# Altium project Propeller dev board.PrjPcb
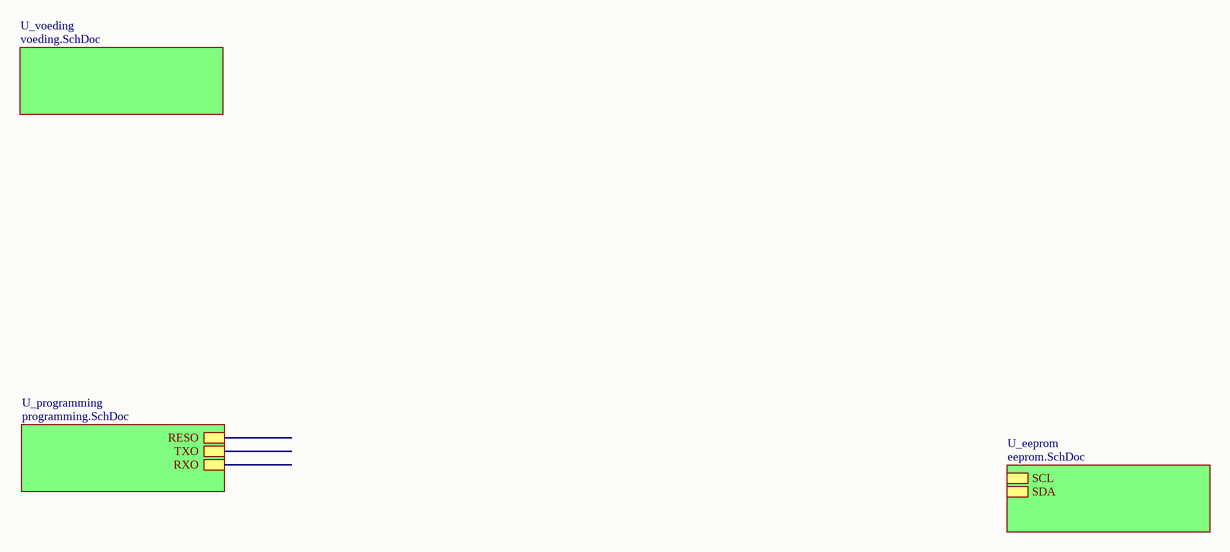
[diagram p0: top.SchDoc]
8 sheets, 54 parts. Net scope: hierarchical (ports join the sheet entries above them; power ports are global).
Sheets:
  top.SchDoc
    U_voeding = voeding.SchDoc
    U_programming = programming.SchDoc
    U_eeprom = eeprom.SchDoc
  output.SchDoc
  controller.SchDoc
  levelshifter2.SchDoc
  levelshifter1.SchDoc

## Sheet top.SchDoc
size A

### Sub-sheets
U_eeprom = eeprom.SchDoc: SCL, SDA
U_programming = programming.SchDoc: RESO, TXO, RXO
U_voeding = voeding.SchDoc: no entries

## Sheet voeding.SchDoc
size A
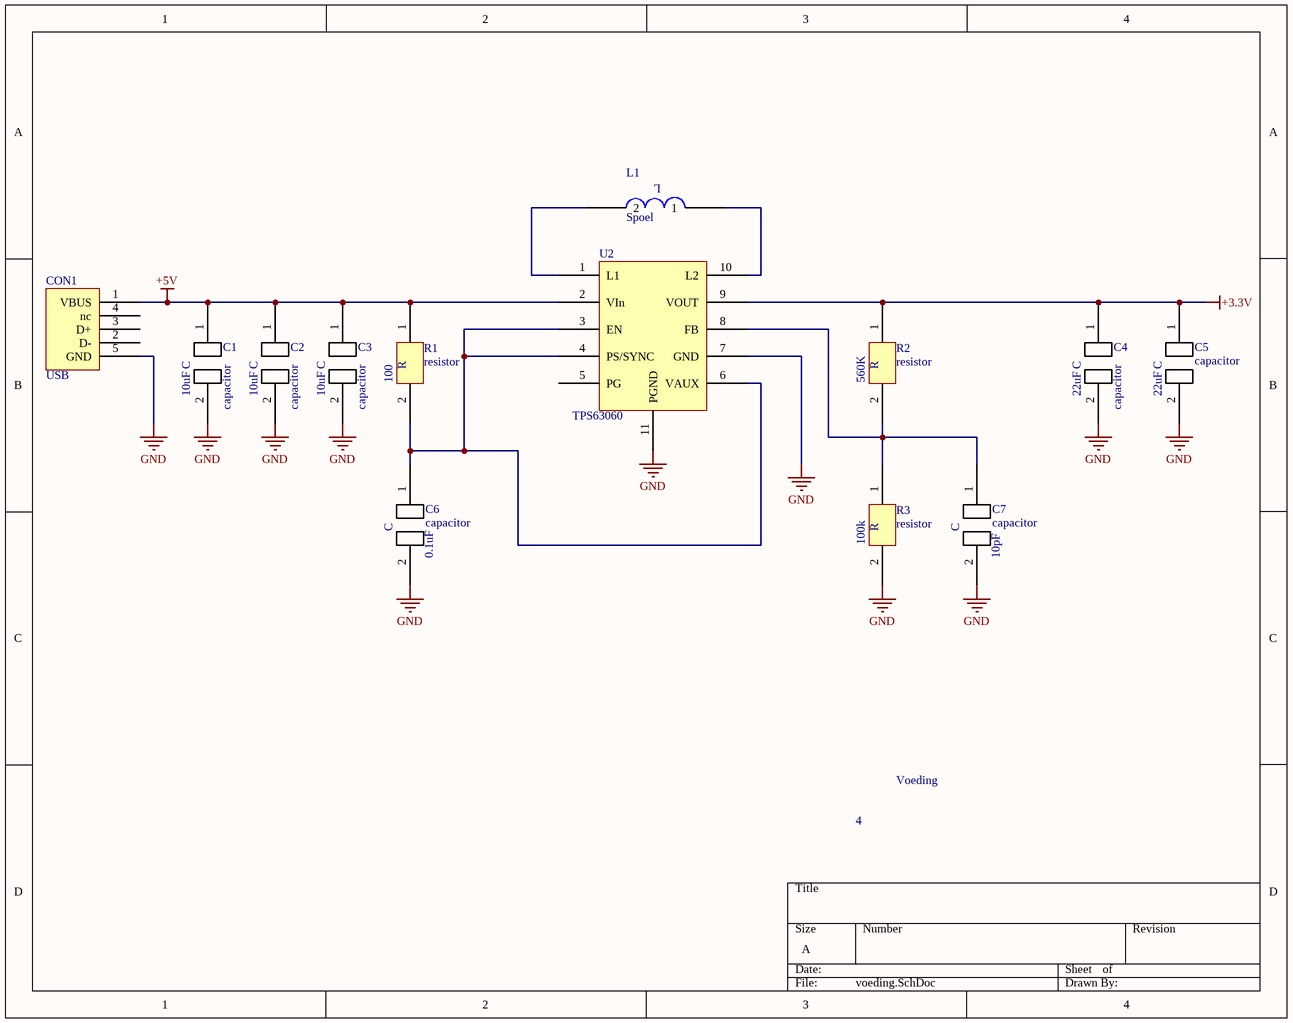
[diagram p1: voeding.SchDoc]

### Parts
C1  capacitor  value 10uF  [0603]
C2  capacitor  value 10uF  [0603]
C3  capacitor  value 10uF  [0603]
C4  capacitor  value 22uF  [0603]
C5  capacitor  value 22uF  [0603]
C6  capacitor  [0805]
C7  capacitor  [0805]
CON1  USB  [USB]
L1  Spoel  [Coilcraft , XFL4020-102]
R1  resistor  value 100  [0603]
R2  resistor  value 560K  [0603]
R3  resistor  value 100k  [0603]
U2  TPS63060  [TPS63060]

### Nets
+3.3V: C4.1 C5.1 R2.1 U2.9(VOUT)
+5V: C1.1 C2.1 C3.1 CON1.1(VBUS) R1.1 U2.2(VIn)
GND: C1.2 C2.2 C3.2 C4.2 C5.2 C6.2 C7.2 CON1.5(GND) R3.2 U2.7(GND) U2.11(PGND)
NetC6_1: C6.1 R1.2 U2.3(EN) U2.4(PS/SYNC) U2.6(VAUX)
NetC7_1: C7.1 R2.2 R3.1 U2.8(FB)
NetL1_1: L1.1 U2.10(L2)
NetL1_2: L1.2 U2.1(L1)

Not connected (* = marked no-connect by the designer): CON1 2(D-) 3(D+) 4(nc); U2 5(PG)

### Notes on the sheet
- 4
- Voeding
- (in symbol capacitor) C; 10pF; 0.1uF
- (in symbol resistor) R
- (in symbol Spoel) L

## Sheet programming.SchDoc
size A
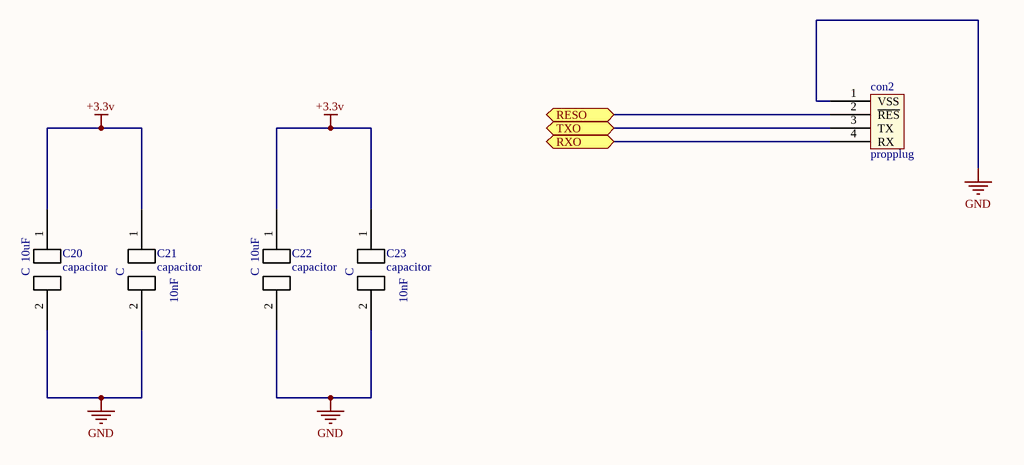
[diagram p2: programming.SchDoc]

### Parts
C20  capacitor  [0603]
C21  capacitor  [0603]
C22  capacitor  [0603]
C23  capacitor  [0603]
con2  propplug

### Ports
RESO, RXO, TXO

### Nets
+3.3V: C20.1 C21.1 C22.1 C23.1
GND: C20.2 C21.2 C22.2 C23.2 con2.1(VSS)
Netcon2_2: con2.2(~{RES}) ; port RESO
Netcon2_3: con2.3(TX) ; port TXO
Netcon2_4: con2.4(RX) ; port RXO

### Notes on the sheet
- (in symbol capacitor) 10uF; C; 10nF

## Sheet eeprom.SchDoc
size A
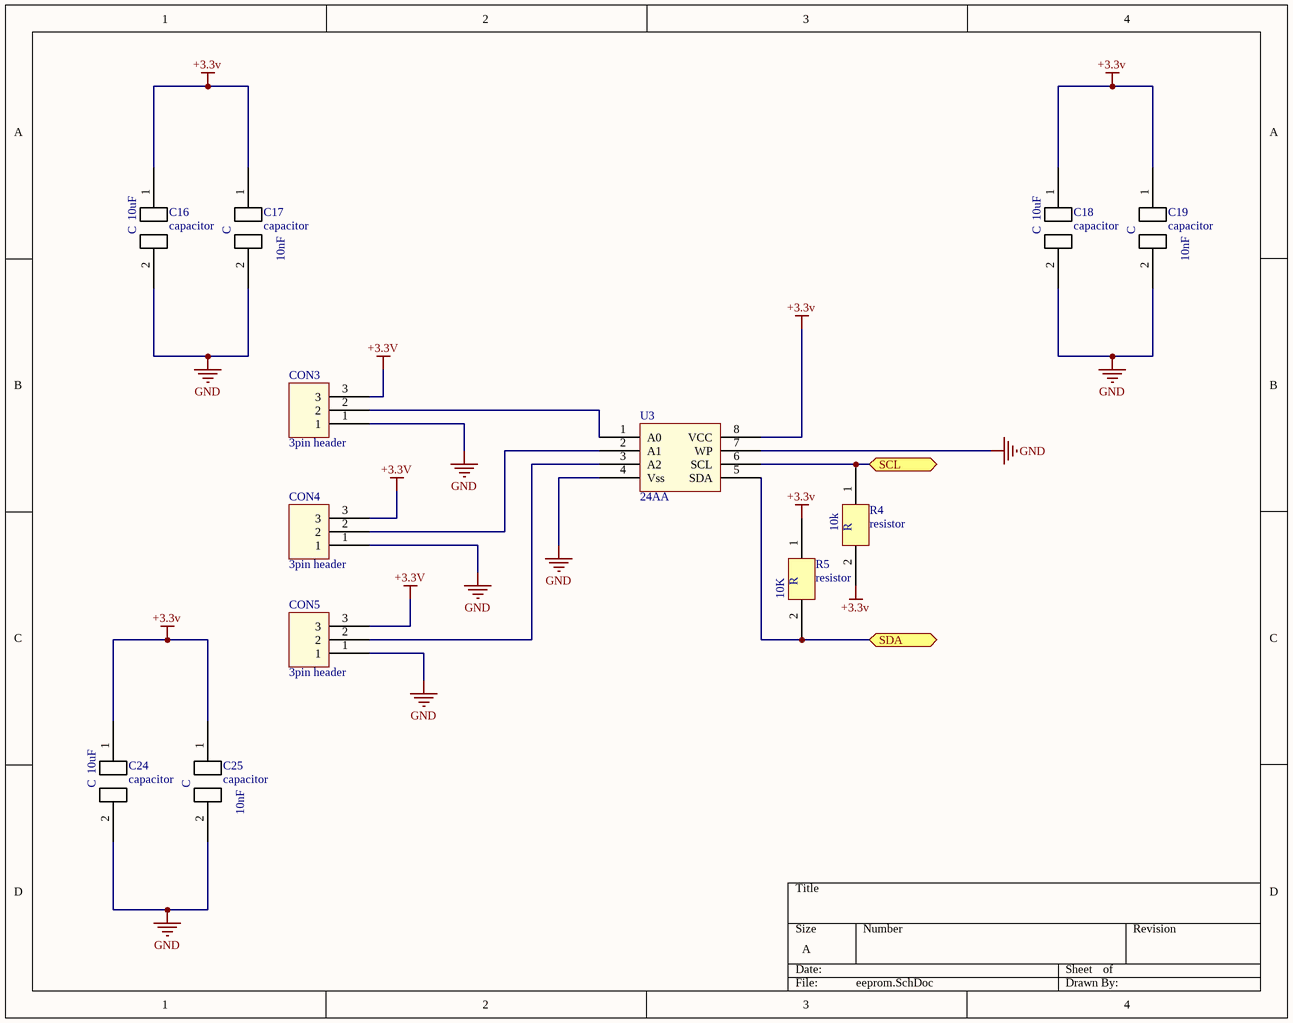
[diagram p3: eeprom.SchDoc]

### Parts
C16  capacitor  [0603]
C17  capacitor  [0603]
C18  capacitor  [0603]
C19  capacitor  [0603]
C24  capacitor  [0603]
C25  capacitor  [0603]
CON3  3pin header  [PCBComponent_1]
CON4  3pin header  [PCBComponent_1]
CON5  3pin header  [PCBComponent_1]
R4  resistor  [0603]
R5  resistor  [0603]
U3  24AA  [24AA soic]

### Ports
SCL, SDA

### Nets
+3.3V: C16.1 C17.1 C18.1 C19.1 C24.1 C25.1 CON3.3 CON4.3 CON5.3 R4.2 R5.1 U3.8(VCC)
GND: C16.2 C17.2 C18.2 C19.2 C24.2 C25.2 CON3.1 CON4.1 CON5.1 U3.4(Vss) U3.7(WP)
NetCON3_2: CON3.2 U3.1(A0)
NetCON4_2: CON4.2 U3.2(A1)
NetCON5_2: CON5.2 U3.3(A2)
NetR4_1: R4.1 U3.6(SCL) ; port SCL
NetR5_2: R5.2 U3.5(SDA) ; port SDA

### Notes on the sheet
- (in symbol capacitor) 10uF; C; 10nF
- (in symbol resistor) R; 10K; 10k

## Sheet output.SchDoc
size A

## Sheet controller.SchDoc
size A
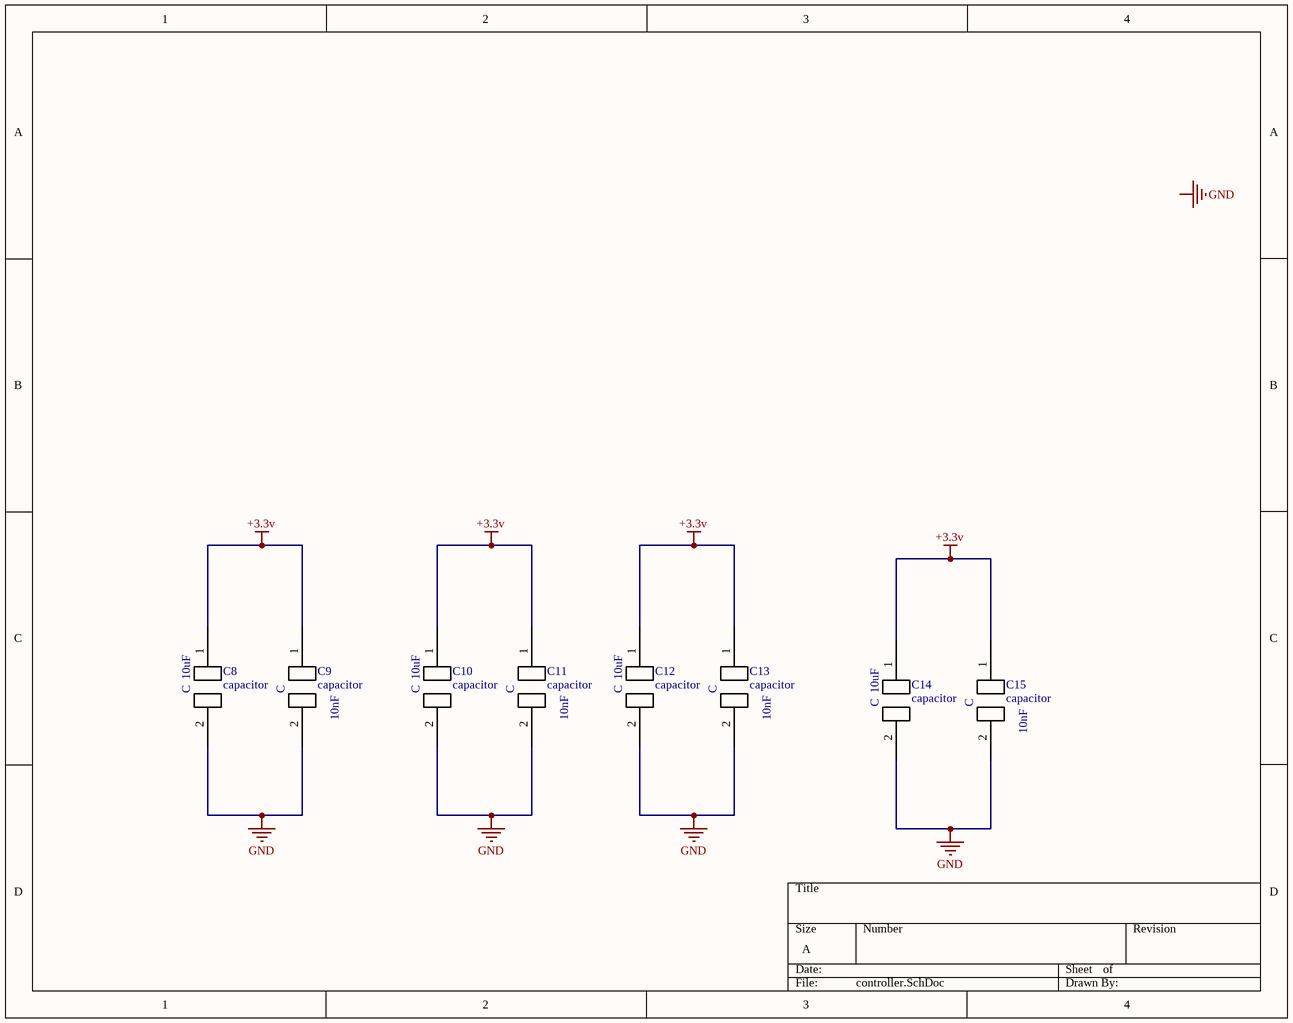
[diagram p4: controller.SchDoc]

### Parts
C8  capacitor  [0603]
C9  capacitor  [0603]
C10  capacitor  [0603]
C11  capacitor  [0603]
C12  capacitor  [0603]
C13  capacitor  [0603]
C14  capacitor  [0603]
C15  capacitor  [0603]

### Nets
+3.3V: C8.1 C9.1 C10.1 C11.1 C12.1 C13.1 C14.1 C15.1
GND: C8.2 C9.2 C10.2 C11.2 C12.2 C13.2 C14.2 C15.2

### Notes on the sheet
- Labels drawn without touching a wire or pin: GND
- (in symbol capacitor) 10uF; C; 10nF

## Sheet levelshifter2.SchDoc
size A

## Sheet levelshifter1.SchDoc
size A
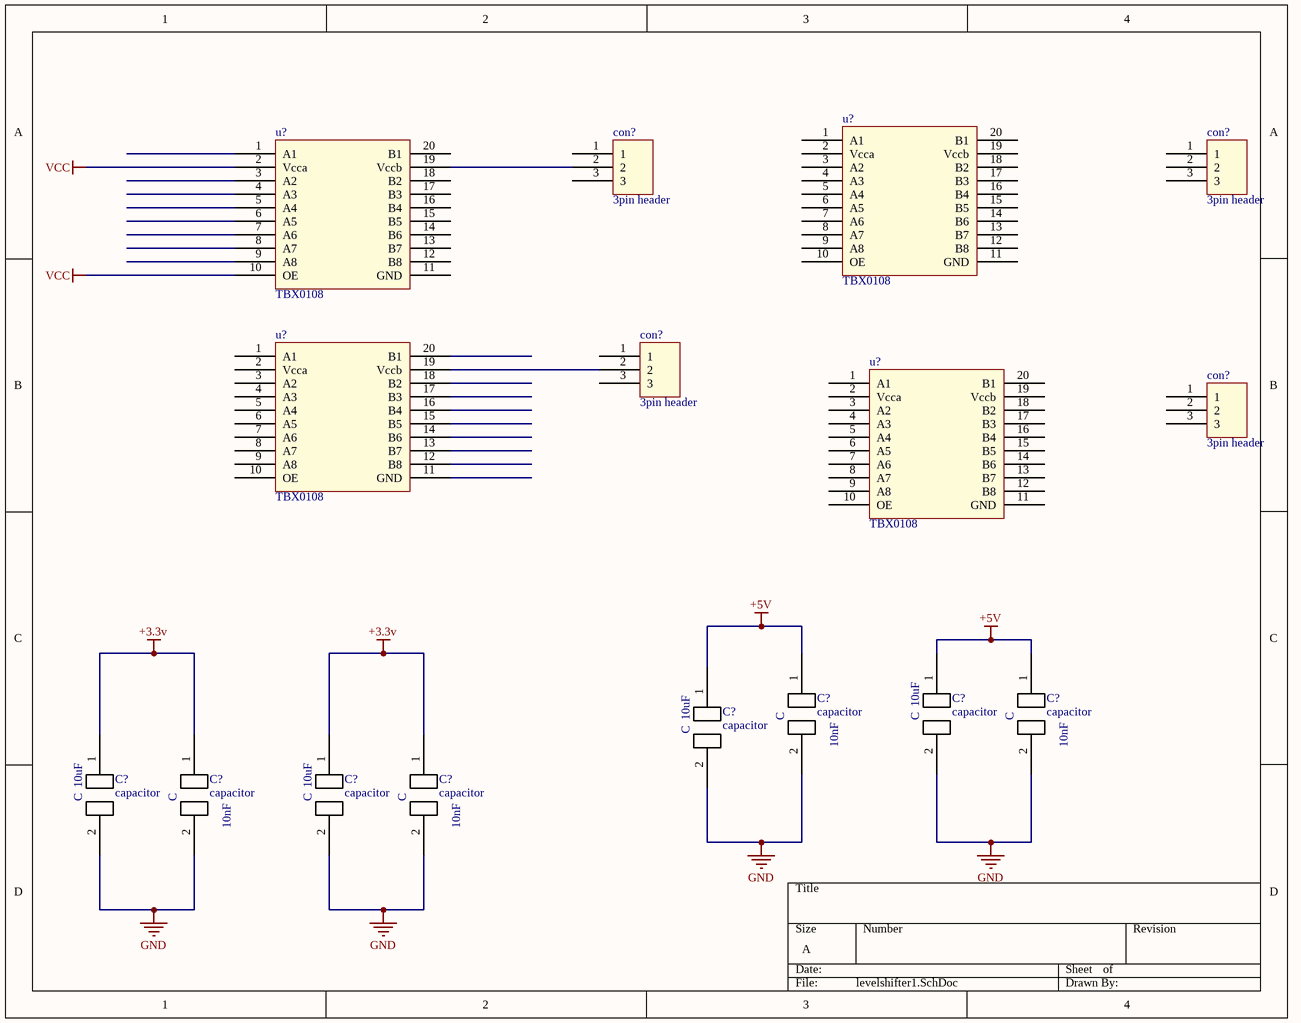
[diagram p5: levelshifter1.SchDoc]

### Parts
(Parts that share a designator on the sheet are numbered #1, #2 ... from top to bottom, then left to right.)
C?#1  capacitor  [0603]
C?#2  capacitor  [0603]
C?#3  capacitor  [0603]
C?#4  capacitor  [0603]
C?#5  capacitor  [0603]
C?#6  capacitor  [0603]
C?#7  capacitor  [0603]
C?#8  capacitor  [0603]
con?#1  3pin header  [PCBComponent_1]
con?#2  3pin header  [PCBComponent_1]
con?#3  3pin header  [PCBComponent_1]
con?#4  3pin header  [PCBComponent_1]
u?#1  TBX0108  [TXB0810]
u?#2  TBX0108  [TXB0810]
u?#3  TBX0108  [TXB0810]
u?#4  TBX0108  [TXB0810]

### Nets
+3.3V: C?#5.1 C?#6.1 C?#7.1 C?#8.1
+5V: C?#1.1 C?#2.1 C?#3.1 C?#4.1
GND: C?#1.2 C?#2.2 C?#3.2 C?#4.2 C?#5.2 C?#6.2 C?#7.2 C?#8.2
VCC: u?#2.2(Vcca) u?#2.10(OE)
Netcon?#1_2: con?#1.2 u?#2.19(Vccb)
Netcon?#3_2: con?#3.2 u?#3.19(Vccb)

Not connected (* = marked no-connect by the designer): con?#1 1 3; con?#2 1 2 3; con?#3 1 3; con?#4 1 2 3; u?#1 1(A1) 2(Vcca) 3(A2) 4(A3) 5(A4) 6(A5) 7(A6) 8(A7) 9(A8) 10(OE) 11(GND) 12(B8) 13(B7) 14(B6) 15(B5) 16(B4) 17(B3) 18(B2) 19(Vccb) 20(B1); u?#2 1(A1) 3(A2) 4(A3) 5(A4) 6(A5) 7(A6) 8(A7) 9(A8) 11(GND) 12(B8) 13(B7) 14(B6) 15(B5) 16(B4) 17(B3) 18(B2) 20(B1); u?#3 1(A1) 2(Vcca) 3(A2) 4(A3) 5(A4) 6(A5) 7(A6) 8(A7) 9(A8) 10(OE) 11(GND) 12(B8) 13(B7) 14(B6) 15(B5) 16(B4) 17(B3) 18(B2) 20(B1); u?#4 1(A1) 2(Vcca) 3(A2) 4(A3) 5(A4) 6(A5) 7(A6) 8(A7) 9(A8) 10(OE) 11(GND) 12(B8) 13(B7) 14(B6) 15(B5) 16(B4) 17(B3) 18(B2) 19(Vccb) 20(B1)

### Notes on the sheet
- (in symbol capacitor) 10uF; C; 10nF

## Nets that join several sheets
+3.3V: voeding (C4.1 C5.1 R2.1 U2.9), programming (C20.1 C21.1 C22.1 C23.1), eeprom (12 pins), controller (8 pins), levelshifter1 (C?#5.1 C?#6.1 C?#7.1 C?#8.1)
+5V: voeding (6 pins), levelshifter1 (C?#1.1 C?#2.1 C?#3.1 C?#4.1)
GND: voeding (11 pins), programming (5 pins), eeprom (11 pins), controller (8 pins), levelshifter1 (8 pins)